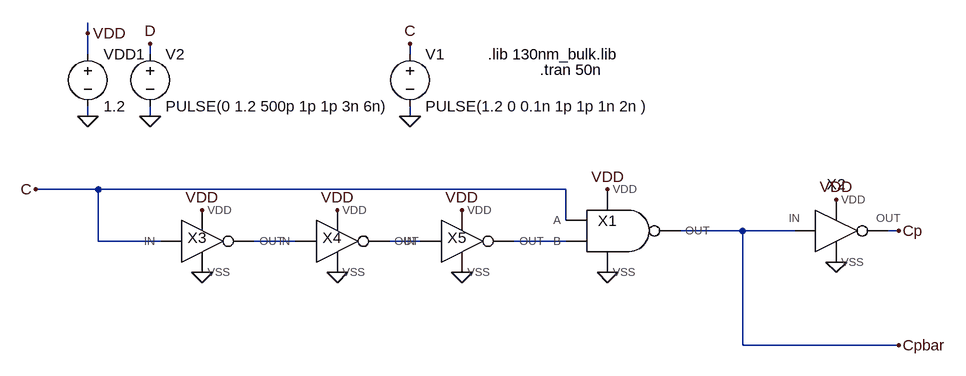
[diagram p0: schematic Prob7a.asc]
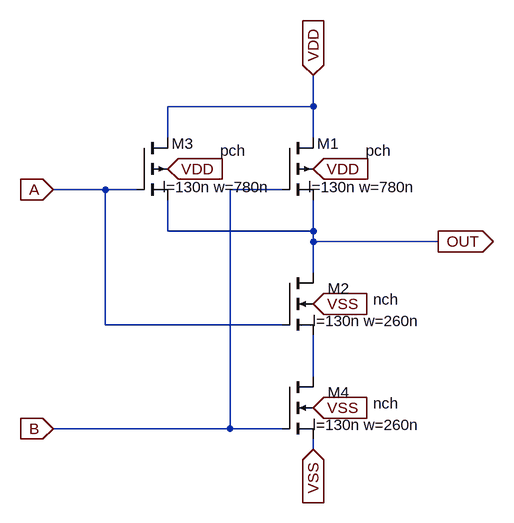
[diagram p1: sub-circuit nand2.asc]
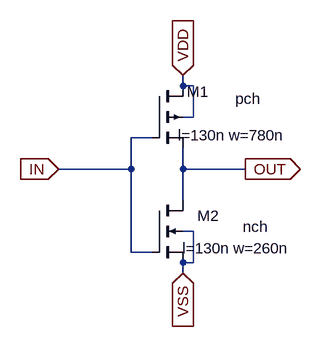
[diagram p2: sub-circuit inverter1.asc]
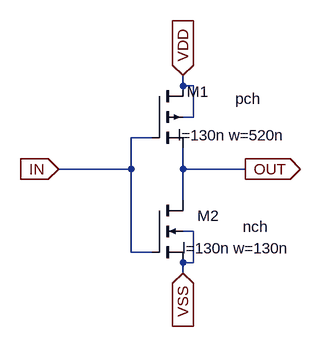
[diagram p3: sub-circuit inverter3.asc]
Prob7a.asc, the LTspice schematic file:
Version 4.1
SHEET 1 880 748
WIRE -880 208 -880 192
WIRE -880 240 -880 208
WIRE -784 240 -784 224
WIRE -384 240 -384 224
WIRE -880 336 -880 320
WIRE -784 336 -784 320
WIRE -384 336 -384 320
WIRE -864 448 -960 448
WIRE -144 448 -864 448
WIRE -144 496 -144 448
WIRE 128 512 32 512
WIRE 208 512 128 512
WIRE 368 512 352 512
WIRE -864 528 -864 448
WIRE -768 528 -864 528
WIRE -560 528 -624 528
WIRE -368 528 -416 528
WIRE -144 528 -224 528
WIRE 128 688 128 512
WIRE 368 688 128 688
FLAG -384 336 0
FLAG -384 224 C
FLAG -784 336 0
FLAG -784 224 D
FLAG -880 336 0
FLAG -880 208 VDD
FLAG -80 576 0
FLAG 272 560 0
FLAG -304 576 0
FLAG -496 576 0
FLAG -704 576 0
FLAG -704 480 VDD
FLAG -496 480 VDD
FLAG -304 480 VDD
FLAG -80 448 VDD
FLAG 272 464 VDD
FLAG -960 448 C
FLAG 368 512 Cp
FLAG 368 688 Cpbar
SYMBOL voltage -384 224 R0
WINDOW 123 0 0 Left 0
WINDOW 39 0 0 Left 0
SYMATTR InstName V1
SYMATTR Value PULSE(1.2 0 0.1n 1p 1p 1n 2n )
SYMBOL voltage -784 224 R0
WINDOW 123 0 0 Left 0
WINDOW 39 0 0 Left 0
SYMATTR InstName V2
SYMATTR Value PULSE(0 1.2 500p 1p 1p 3n 6n)
SYMBOL voltage -880 224 R0
WINDOW 123 0 0 Left 2
WINDOW 39 0 0 Left 2
SYMATTR InstName VDD1
SYMATTR Value 1.2
SYMBOL Nand2 -80 512 R0
SYMATTR InstName X1
SYMBOL Inverter1 272 512 R0
SYMATTR InstName X2
SYMBOL Inverter3 -704 528 R0
SYMATTR InstName X3
SYMBOL Inverter3 -496 528 R0
SYMATTR InstName X4
SYMBOL Inverter3 -304 528 R0
SYMATTR InstName X5
TEXT -264 240 Left 2 !.lib 130nm_bulk.lib
TEXT -184 264 Left 2 !.tran 50n

nand2.asc, the sub-circuit schematic file:
Version 4.1
SHEET 1 880 680
WIRE 128 -160 128 -208
WIRE 128 -160 -96 -160
WIRE -96 -112 -96 -160
WIRE 128 -112 128 -160
WIRE -192 -32 -272 -32
WIRE -144 -32 -192 -32
WIRE 80 -32 0 -32
WIRE -96 32 -96 -16
WIRE 128 32 128 -16
WIRE 128 32 -96 32
WIRE 128 48 128 32
WIRE 320 48 128 48
WIRE 128 96 128 48
WIRE -192 176 -192 -32
WIRE 80 176 -192 176
WIRE 128 256 128 192
WIRE 0 336 0 -32
WIRE 0 336 -272 336
WIRE 80 336 0 336
WIRE 128 368 128 352
FLAG -96 -64 VDD
IOPIN -96 -64 In
FLAG 128 -64 VDD
IOPIN 128 -64 In
FLAG 128 144 VSS
IOPIN 128 144 In
FLAG 128 304 VSS
IOPIN 128 304 In
FLAG 128 368 VSS
IOPIN 128 368 In
FLAG 128 -208 VDD
IOPIN 128 -208 In
FLAG -272 -32 A
IOPIN -272 -32 In
FLAG -272 336 B
IOPIN -272 336 In
FLAG 320 48 OUT
IOPIN 320 48 Out
SYMBOL pmos4 80 -112 R0
WINDOW 0 88 9 Right 2
WINDOW 3 168 20 Right 2
WINDOW 123 206 76 Right 2
SYMATTR InstName M1
SYMATTR Value pch
SYMATTR Value2 l=130n w=780n
SYMBOL nmos4 80 96 R0
WINDOW 0 104 24 Right 2
WINDOW 3 179 41 Right 2
WINDOW 123 213 74 Right 2
SYMATTR InstName M2
SYMATTR Value nch
SYMATTR Value2 l=130n w=260n
SYMBOL pmos4 -144 -112 R0
WINDOW 0 88 9 Right 2
WINDOW 3 168 20 Right 2
WINDOW 123 206 76 Right 2
SYMATTR InstName M3
SYMATTR Value pch
SYMATTR Value2 l=130n w=780n
SYMBOL nmos4 80 256 R0
WINDOW 0 104 24 Right 2
WINDOW 3 179 41 Right 2
WINDOW 123 213 74 Right 2
SYMATTR InstName M4
SYMATTR Value nch
SYMATTR Value2 l=130n w=260n

inverter1.asc, the sub-circuit schematic file:
Version 4.1
SHEET 1 880 680
WIRE 176 32 176 16
WIRE 192 32 176 32
WIRE 192 80 192 32
WIRE 192 80 176 80
WIRE 128 112 96 112
WIRE 96 160 96 112
WIRE 96 160 -16 160
WIRE 176 160 176 128
WIRE 272 160 176 160
WIRE 176 208 176 160
WIRE 192 256 176 256
WIRE 96 288 96 160
WIRE 128 288 96 288
WIRE 192 304 192 256
WIRE 192 304 176 304
WIRE 176 320 176 304
FLAG -16 160 IN
IOPIN -16 160 In
FLAG 176 16 VDD
IOPIN 176 16 In
FLAG 176 320 VSS
IOPIN 176 320 In
FLAG 272 160 OUT
IOPIN 272 160 Out
SYMBOL pmos4 128 32 R0
WINDOW 0 88 9 Right 2
WINDOW 3 168 20 Right 2
WINDOW 123 206 76 Right 2
SYMATTR InstName M1
SYMATTR Value pch
SYMATTR Value2 l=130n w=780n
SYMBOL nmos4 128 208 R0
WINDOW 0 104 24 Right 2
WINDOW 3 179 41 Right 2
WINDOW 123 213 74 Right 2
SYMATTR InstName M2
SYMATTR Value nch
SYMATTR Value2 l=130n w=260n

inverter3.asc, the sub-circuit schematic file:
Version 4.1
SHEET 1 880 680
WIRE 160 -64 160 -80
WIRE 176 -64 160 -64
WIRE 176 -16 176 -64
WIRE 176 -16 160 -16
WIRE 112 16 80 16
WIRE 80 64 80 16
WIRE 80 64 -32 64
WIRE 160 64 160 32
WIRE 256 64 160 64
WIRE 160 112 160 64
WIRE 176 160 160 160
WIRE 80 192 80 64
WIRE 112 192 80 192
WIRE 176 208 176 160
WIRE 176 208 160 208
WIRE 160 224 160 208
FLAG -32 64 IN
IOPIN -32 64 In
FLAG 160 -80 VDD
IOPIN 160 -80 In
FLAG 160 224 VSS
IOPIN 160 224 In
FLAG 256 64 OUT
IOPIN 256 64 Out
SYMBOL pmos4 112 -64 R0
WINDOW 0 88 9 Right 2
WINDOW 3 168 20 Right 2
WINDOW 123 206 76 Right 2
SYMATTR InstName M1
SYMATTR Value pch
SYMATTR Value2 l=130n w=520n
SYMBOL nmos4 112 112 R0
WINDOW 0 104 24 Right 2
WINDOW 3 179 41 Right 2
WINDOW 123 213 74 Right 2
SYMATTR InstName M2
SYMATTR Value nch
SYMATTR Value2 l=130n w=130n

The netlist it stands for:
* Prob7a.asc
V1 C 0 PULSE(1.2 0 0.1n 1p 1p 1n 2n )
V2 D 0 PULSE(0 1.2 500p 1p 1p 3n 6n)
VDD1 VDD 0 1.2
X§X1 C N003 VDD 0 Cpbar nand2
X§X2 Cpbar VDD 0 Cp inverter1
X§X3 C VDD 0 N001 inverter3
X§X4 N001 VDD 0 N002 inverter3
X§X5 N002 VDD 0 N003 inverter3

* block symbol definitions
.subckt nand2 A B VDD VSS OUT
M1 VDD B OUT VDD pch l=130n w=780n
M2 OUT A N001 VSS nch l=130n w=260n
M3 VDD A OUT VDD pch l=130n w=780n
M4 N001 B VSS VSS nch l=130n w=260n
.ends nand2

.subckt inverter1 IN VDD VSS OUT
M1 VDD IN OUT VDD pch l=130n w=780n
M2 OUT IN VSS VSS nch l=130n w=260n
.ends inverter1

.subckt inverter3 IN VDD VSS OUT
M1 VDD IN OUT VDD pch l=130n w=520n
M2 OUT IN VSS VSS nch l=130n w=130n
.ends inverter3

.model NMOS NMOS
.model PMOS PMOS
.lib standard.mos
.lib 130nm_bulk.lib
.tran 50n
.backanno
.end